# Altium schematic sheet Galaxy.SchDoc
size A3; DocumentNumber: 1; SheetNumber: 1; SheetTotal: 1
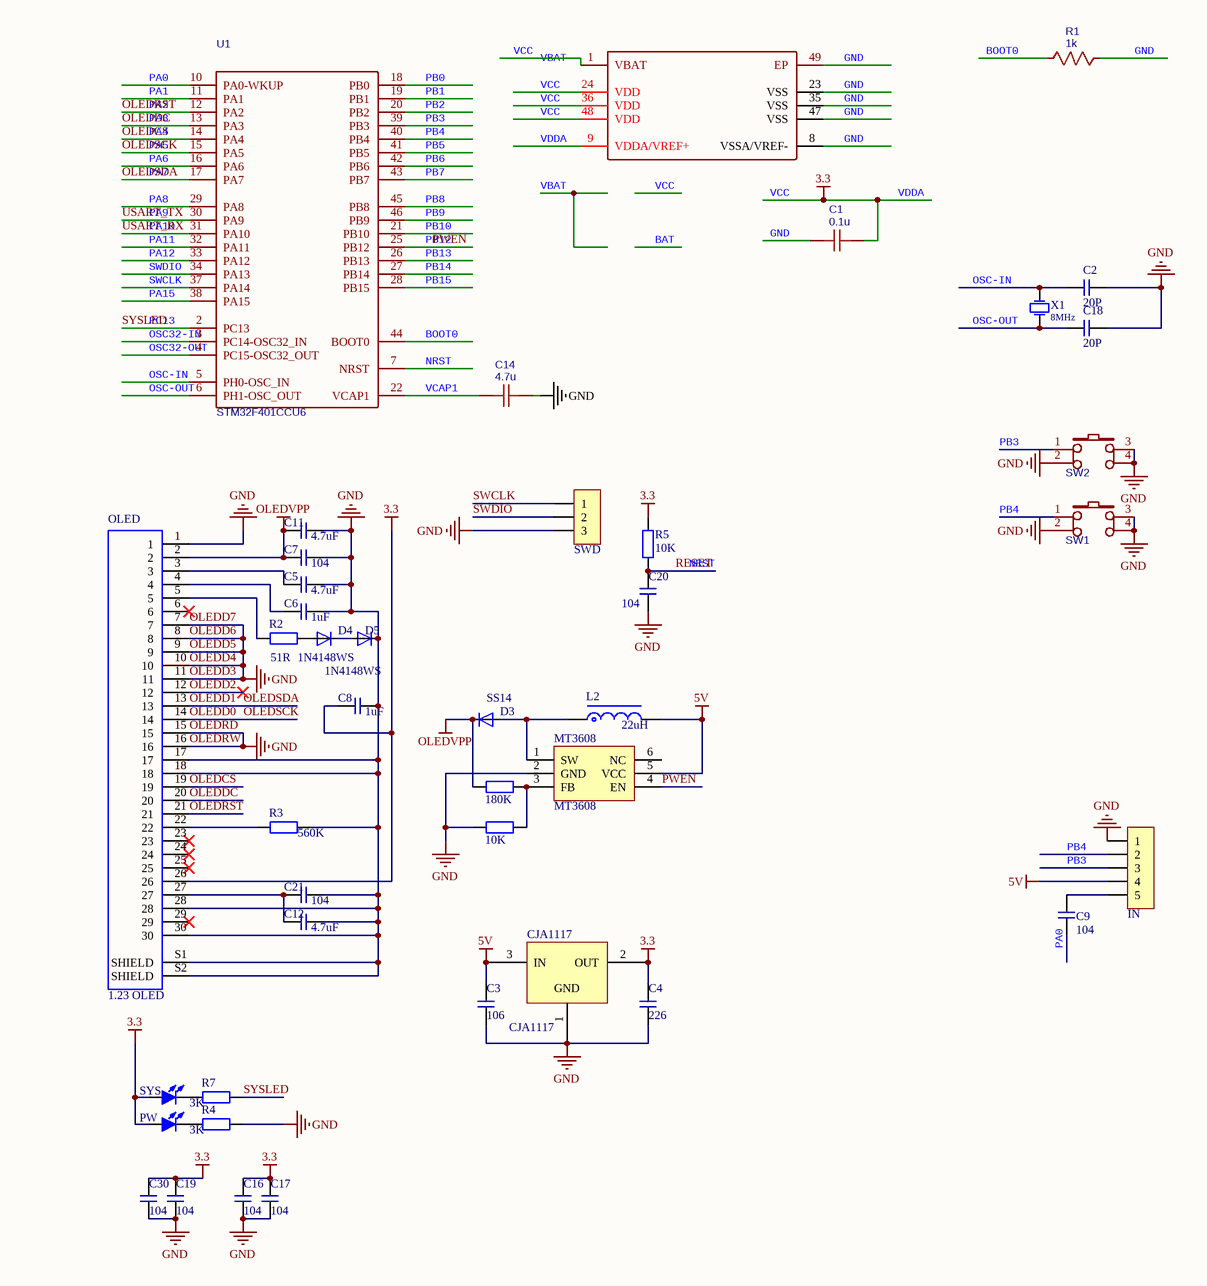
[diagram p0: Galaxy.SchDoc]

## Parts
C1  0.1u  [0603C]
C2  20P  [0603C]
C3  106  [0603C]
C4  226  [0603C]
C5  4.7uF  [0603C]
C6  1uF  [0603C]
C7  104  [0603C]
C8  1uF  [0603C]
C9  104  [0603C]
C11  4.7uF  [0603C]
C12  4.7uF  [0603C]
C14  4.7u  [0603C]
C16  104  [0603C]
C17  104  [0603C]
C18  20P  [0603C]
C19  104  [0603C]
C20  104  [0603C]
C21  104  [0603C]
C30  104  [0603C]
CJA1117  CJA1117  [SOT-89-3]
D3  SS14  [SOD323_1N4148WS]
D4  1N4148WS  [SOD323_1N4148WS]
D5  1N4148WS  [SOD323_1N4148WS]
IN  HDR-1X5  [ZH1.5-LS-5P]  (value not drawn)
L2  22uH  [1210-ec]
MT3608  MT3608  [SOT23-6N]
OLED  1.23 OLED  [1.23 OLED]
PW  白色  [0603LED]  (value not drawn)
R1  1k  [0603R]
R2  51R  [0603R]
R3  560K  [0603R]
R4  3K  [0603R]
R5  10K  [0603R]
R7  3K  [0603R]
RB  180K  [0603R]
RS  10K  [0603R]
SW1  Button-SMD-4x4x1.5  [SW-SMD_TS-1086E-16]  (value not drawn)
SW2  Button-SMD-4x4x1.5  [SW-SMD_TS-1086E-16]  (value not drawn)
SWD  HDR-1X3  [ZH1.5-LI-3P]  (value not drawn)
SYS  粉色  [0603LED]  (value not drawn)
U1  STM32F401CCU6  [UFQFPN-48_L7.0-W7.0-P0.50-BL-EP]
X1  value 8MHz  [OSC 5032-2P]  (hidden comment: 1.6.1.01.005.001)

## Nets
5V: C3.1 CJA1117.3(IN) IN.4 L2.2 MT3608.5(VCC)
GND: C1.2 C2.1 C3.2 C4.2 C5.2 C6.2 C7.2 C8.2 C11.2 C12.2 C14.2 C16.2 C17.2 C18.1 C19.2 C20.2 C21.2 C30.2 CJA1117.1(GND) D5.C IN.1 MT3608.2(GND) OLED.1 OLED.7 OLED.8 OLED.9 OLED.10 OLED.11 OLED.15 OLED.16 OLED.17 OLED.18 OLED.28 OLED.30 OLED.S1(SHIELD) OLED.S2(SHIELD) R1.2 R3.1 R4.1 RS.1 SW1.2 SW1.3 SW1.4 SW2.2 SW2.3 SW2.4 SWD.3 U1.8(VSSA/VREF-) U1.23(VSS) U1.35(VSS) U1.47(VSS) U1.49(EP)  [also labelled OLEDD3, OLEDD4, OLEDD5, OLEDD6, OLEDD7, OLEDRD, OLEDRW]
OLEDVPP: C7.1 C11.1 D3.C OLED.2 RB.1
VCC: C1.1 C4.1 C8.1 C16.1 C17.1 C19.1 C30.1 CJA1117.2(OUT) OLED.26 PW.1(A) R5.1 SYS.1(A) U1.1(VBAT) U1.9(VDDA/VREF+) U1.24(VDD) U1.36(VDD) U1.48(VDD)  [also labelled 3.3, VDDA]
BOOT0: R1.1 U1.44(BOOT0)
NRST: C20.1 R5.2 U1.7(NRST)  [also labelled RESET]
OLEDCS: OLED.19 U1.14(PA4)  [also labelled PA4]
OLEDD0: OLED.14 U1.15(PA5)  [also labelled OLEDSCK, PA5]
OLEDD1: OLED.13 U1.17(PA7)  [also labelled OLEDSDA, PA7]
OLEDD2: OLED.12
OLEDDC: OLED.20 U1.13(PA3)  [also labelled PA3]
OLEDRST: OLED.21 U1.12(PA2)  [also labelled PA2]
OSC32-IN: U1.3(PC14-OSC32_IN)
OSC32-OUT: U1.4(PC15-OSC32_OUT)
OSC-IN: C2.2 U1.5(PH0-OSC_IN) X1.1(OSC1)
OSC-OUT: C18.2 U1.6(PH1-OSC_OUT) X1.2(OSC2)
PA0: C9.1 U1.10(PA0-WKUP)
PA1: U1.11(PA1)
PA6: U1.16(PA6)
PA8: U1.29(PA8)
PA9: U1.30(PA9)  [also labelled USART_TX]
PA10: U1.31(PA10)  [also labelled USART_RX]
PA11: U1.32(PA11)
PA12: U1.33(PA12)
PA15: U1.38(PA15)
PB0: U1.18(PB0)
PB1: U1.19(PB1)
PB2: U1.20(PB2)
PB3: IN.3 SW2.1 U1.39(PB3)
PB4: IN.2 SW1.1 U1.40(PB4)
PB5: U1.41(PB5)
PB6: U1.42(PB6)
PB7: U1.43(PB7)
PB8: U1.45(PB8)
PB9: U1.46(PB9)
PB10: U1.21(PB10)
PB12: MT3608.4(EN) U1.25(PB12)  [also labelled PWEN]
PB13: U1.26(PB13)
PB14: U1.27(PB14)
PB15: U1.28(PB15)
PC13: R7.1 U1.2(PC13)  [also labelled SYSLED]
SWCLK: SWD.1 U1.37(PA14)
SWDIO: SWD.2 U1.34(PA13)
VCAP1: C14.1 U1.22(VCAP1)
NetC5_1: C5.1 OLED.3
NetC6_1: C6.1 OLED.4
NetC9_2: C9.2 IN.5
NetC12_1: C12.1 C21.1 OLED.27
NetD3_A: D3.A L2.1 MT3608.1(SW)
NetD4_A: D4.A R2.1
NetD4_C: D4.C D5.A
NetMT3608_3: MT3608.3(FB) RB.2 RS.2
NetOLED_5: OLED.5 R2.2
NetOLED_22: OLED.22 R3.2
NetPW_2: PW.2(K) R4.2
NetR7_2: R7.2 SYS.2(K)

Not connected (* = marked no-connect by the designer): MT3608 6(NC); OLED 6* 23* 24* 25* 29*

## Notes on the sheet
- Labels drawn without touching a wire or pin: VBAT

## Library data of the parts
C1 = 0.1u: nameAlias: Value(F); Contributor: LCEDA_Lib; spicePre: C; spiceSymbolName: C_0402_US
C2-C9 C11 C12 C16-C21 C30 = 电容
C14 = 4.7u: nameAlias: Value(F); Contributor: LCEDA_Lib; spicePre: C; spiceSymbolName: C_0402_US
D3-D5 = 1N4148WS: Diode Switching 75V 0.3A 2-Pin SOD-323 T/R; MF: ON Semiconductor; SnapEDA_Link: https://www.snapeda.com/parts/1N4148WS/ON%20Semiconductor/view-part/?ref=snap; Price: None; Availability: Unavailable; MP: 1N4148WS; Package: S-0 Good-Ark; Value: *
IN = Header 5: 5P接插件; 版权归属: 源创客; BOM名称: 5P接插件; 学习资源: www.ooocke.com
L2 = L-CDRH: 功率屏蔽电感; 版权归属: 源创客; BOM名称: 功率屏蔽电感; 学习资源: www.ooocke.com
MT3608 = SX1308: 可调升压芯片; 版权归属: 源创客; BOM名称: 可调升压芯片; 学习资源: www.ooocke.com
OLED = FH12-30S-0.5SH(55): FH12 Series 30 Position 0.5 mm Pitch Surface Mount Right Angle Flip Lock FFC/FPC; MF: Hirose Electric; MP: FH12-30S-0.5SH_55_; Package: None; Availability: Unavailable; SnapEDA_Link: https://www.snapeda.com/parts/FH12-30S-0.5SH%2855%29/Hirose%20Electric%20Co%20Ltd/view-part/?ref=snap; Price: None; Value: *
PW SYS = LED-F234: 方形LED; 版权归属: 源创客; BOM名称: 方形LED; 学习资源: www.ooocke.com
R1 = 1k: Contributor: LCEDA_Lib; spicePre: R; spiceSymbolName: R_0402_US
R2-R5 R7 RB RS = R: 贴片电阻; 版权归属: 源创客; BOM名称: 贴片电阻; 学习资源: www.ooocke.com
SW1 SW2 = Button-SMD-4x4x1.5: BOM_Manufacturer: BBJ; BOM_Manufacturer Part: 4*4*1.5Copper head,260G, 0.25mm,; BOM_Supplier Part: C71830; BOM_Supplier: LCSC; spicePre: S; spiceSymbolName: Button-SMD-4x4x1.5
SWD = Header 3: 3P接插件; 版权归属: 源创客; BOM名称: 3P接插件; 学习资源: www.ooocke.com
U1 = STM32F401CCU6: BOM_Manufacturer: ST; subpart_no: 1; tags: STM32; BOM_Supplier Part: C79861; BOM_Supplier: LCSC; BOM_Manufacturer Part: STM32F401CCU6; spicePre: U; spiceSymbolName: STM32F401CCU6
X1 = 1.6.1.01.005.001: XTAL,8MHz,±20PPM,12.6*4.5; K3 No.: 1.6.1.01.005.001; GENERAL: *